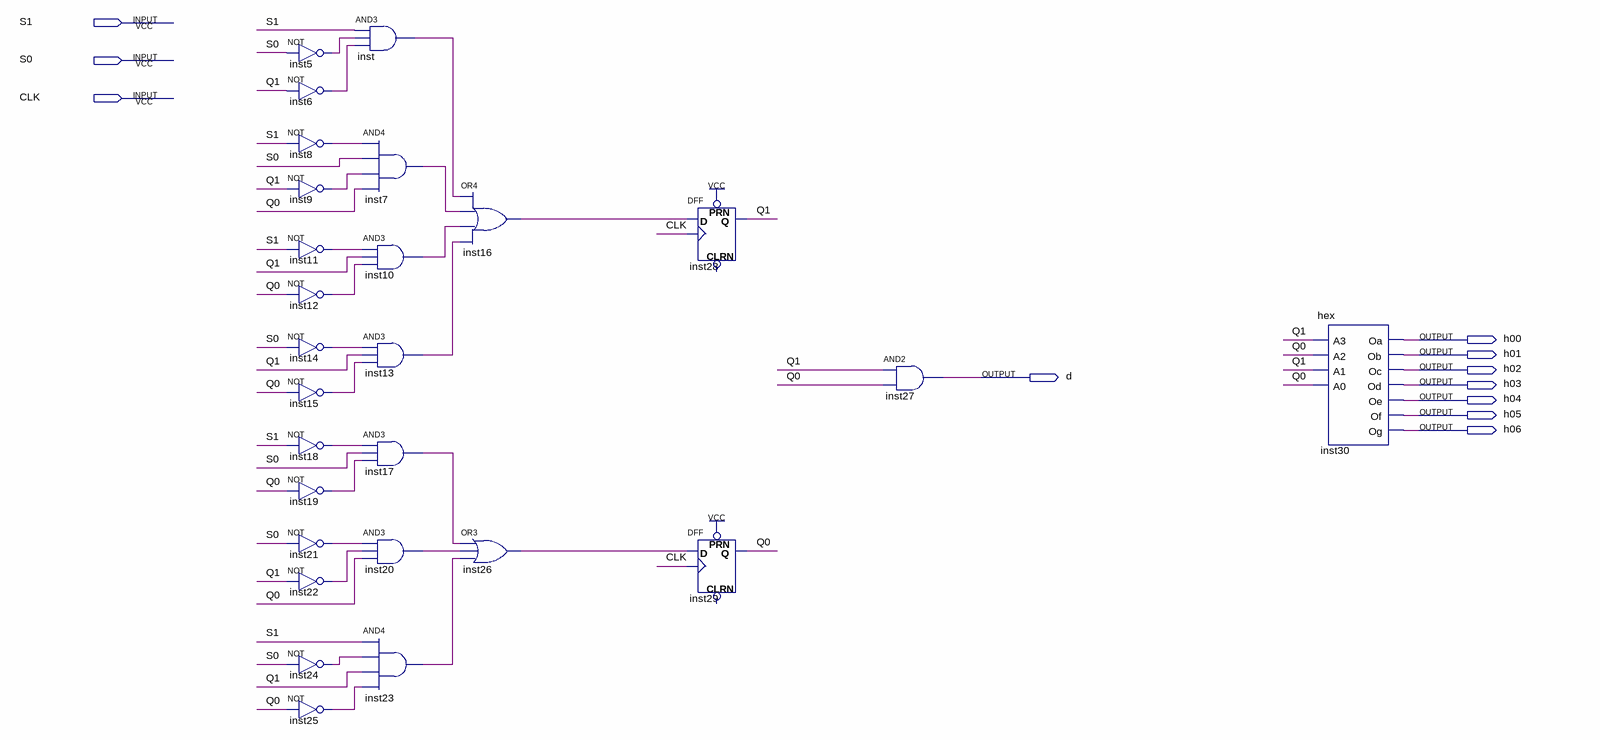
[diagram p0: schematic sheet]
// Quartus schematic hw03.bdf as structural Verilog: 27 symbols, 11 pins
module hw03 (
  input  S1,
  input  S0,
  input  CLK,
  output h00,
  output h01,
  output h02,
  output d,
  output h03,
  output h04,
  output h05,
  output h06
);

  wire inst5_out, inst6_out, inst7_out, inst8_out, inst9_out, inst10_out, inst11_out, inst12_out, inst13_out,
       inst14_out, inst15_out, inst16_out, inst17_out, inst18_out, inst19_out, inst20_out, inst21_out,
       inst22_out, inst23_out, inst24_out, inst25_out, inst26_out, inst_out, Q0, Q1;

  not inst5 (inst5_out, S0);
  not inst6 (inst6_out, Q1);
  not inst8 (inst8_out, S1);
  not inst9 (inst9_out, Q1);
  not inst11 (inst11_out, S1);
  not inst12 (inst12_out, Q0);
  not inst14 (inst14_out, S0);
  not inst15 (inst15_out, Q0);
  not inst18 (inst18_out, S1);
  not inst19 (inst19_out, Q0);
  not inst21 (inst21_out, S0);
  not inst22 (inst22_out, Q1);
  not inst24 (inst24_out, S0);
  not inst25 (inst25_out, Q0);
  and inst (inst_out, S1, inst5_out, inst6_out);
  and inst7 (inst7_out, inst8_out, S0, inst9_out, Q0);
  and inst10 (inst10_out, inst11_out, Q1, inst12_out);
  and inst13 (inst13_out, inst14_out, Q1, inst15_out);
  and inst17 (inst17_out, inst18_out, S0, inst19_out);
  and inst20 (inst20_out, inst21_out, inst22_out, Q0);
  and inst23 (inst23_out, S1, inst24_out, Q1, inst25_out);
  or inst16 (inst16_out, inst_out, inst7_out, inst10_out, inst13_out);
  or inst26 (inst26_out, inst17_out, inst20_out, inst23_out);
  DFF inst28 (.CLK(CLK), .D(inst16_out), .PRN(1'b1), .Q(Q1));  // open: CLRN
  DFF inst29 (.CLK(CLK), .D(inst26_out), .PRN(1'b1), .Q(Q0));  // open: CLRN
  and inst27 (d, Q1, Q0);
  hex inst30 (.A3(Q1), .A2(Q0), .A1(Q1), .A0(Q0), .Oa(h00), .Ob(h01), .Oc(h02), .Od(h03), .Oe(h04), .Of(h05), .Og(h06));
endmodule
